# Altium schematic sheet power.SchDoc
size A
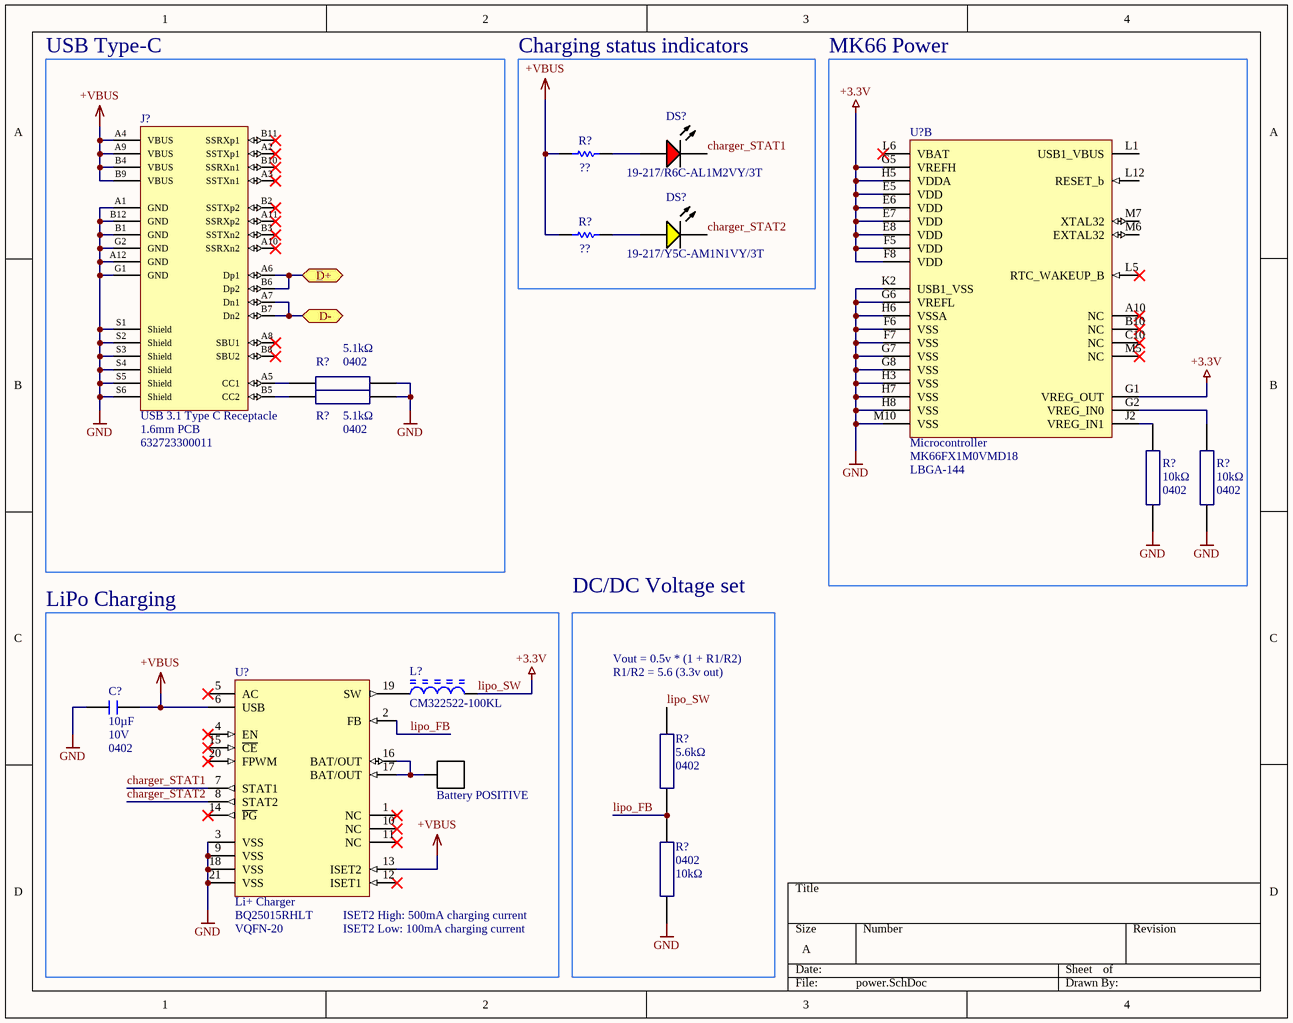
[diagram p0: power.SchDoc]

## Parts
(Parts that share a designator on the sheet are numbered #1, #2 ... from top to bottom, then left to right.)
Battery_POSITIVE  wire_pad_square  [WIRE_PAD_SQUARE]  (value not drawn)  (no BOM)
C?  Capacitance: 10µF  Voltage Rating: 10V  Case Code (Imperial): 0402  [0402_capacitor]  (hidden comment: CL05A106MP8NUB8)
DS?#1  19-217/R6C-AL1M2VY/3T  [EVRL-0603-2_V]
DS?#2  19-217/Y5C-AM1N1VY/3T  [EVRL-0603-2_V]
J?  USB 3.1 Type C Receptacle  PCB Thickness: 1.6mm PCB  [632723300011]
L?  CM322522-100KL  [BOUR-CM322522_V]
R?#1  value ??  [RESC1608X55X25ML10T15]  (hidden comment: Resistor 0R +/- 5% 0603 100 mW)
R?#2  value ??  [RESC1608X55X25ML10T15]  (hidden comment: Resistor 0R +/- 5% 0603 100 mW)
R?#3  Resistance: 5.1kΩ  Size Code: 0402  [0402_resistor]  (hidden comment: RMCF0402FT5K10)
R?#4  Resistance: 5.1kΩ  Size Code: 0402  [0402_resistor]  (hidden comment: RMCF0402FT5K10)
R?#5  Case Code (Imperial): 0402  Resistance: 10kΩ  [0402_resistor]  (hidden comment: RMCF0402FT10K0)
R?#6  Case Code (Imperial): 0402  Resistance: 10kΩ  [0402_resistor]  (hidden comment: RMCF0402FT10K0)
R?#7  Resistance: 5.6kΩ  Size Code: 0402  [0402_resistor]  (hidden comment: RMCF0402FT5K60_1)
R?#8  Case Code (Imperial): 0402  Resistance: 10kΩ  [0402_resistor]  (hidden comment: RMCF0402FT10K0)
U?#1  Microcontroller  Package: LBGA-144  [BGA-144]  (part B of 2)
U?#2  Li+ Charger  [VQFN-20]

## Blocks framed on the sheet
USB Type-C: J? R?#3 R?#4
Charging status indicators: DS?#1 DS?#2 R?#1 R?#2
MK66 Power: R?#5 R?#6 U?#1
LiPo Charging: Battery_POSITIVE C? L? U?#2
DC/DC Voltage set: R?#7 R?#8

## Ports
D+ (bidir), D- (bidir)

## Nets
+VBUS: C?.2 J?.A4(VBUS) J?.A9(VBUS) J?.B4(VBUS) J?.B9(VBUS) R?#1.1 R?#2.1 U?#2.6(USB) U?#2.13(ISET2)
GND: C?.1 J?.A1(GND) J?.A12(GND) J?.B1(GND) J?.B12(GND) J?.G1(GND) J?.G2(GND) J?.S1(Shield) J?.S2(Shield) J?.S3(Shield) J?.S4(Shield) J?.S5(Shield) J?.S6(Shield) R?#3.2 R?#4.2 R?#5.1 R?#6.1 R?#8.1 U?#1.F6(VSS) U?#1.F7(VSS) U?#1.G6(VREFL) U?#1.G7(VSS) U?#1.G8(VSS) U?#1.H3(VSS) U?#1.H6(VSSA) U?#1.H7(VSS) U?#1.H8(VSS) U?#1.K2(USB1_VSS) U?#1.M10(VSS) U?#2.3(VSS) U?#2.9(VSS) U?#2.18(VSS) U?#2.21(VSS)
lipo_SW: L?.2 R?#7.2 U?#1.E5(VDD) U?#1.E6(VDD) U?#1.E7(VDD) U?#1.E8(VDD) U?#1.F5(VDD) U?#1.F8(VDD) U?#1.G1(VREG_OUT) U?#1.G5(VREFH) U?#1.H5(VDDA)  [also labelled +3.3V]
charger_STAT1: DS?#1.2(K) U?#2.7(STAT1)
charger_STAT2: DS?#2.2(K) U?#2.8(STAT2)
D+: J?.A6(Dp1) J?.B6(Dp2) ; port D+
D-: J?.A7(Dn1) J?.B7(Dn2) ; port D-
lipo_FB: R?#7.1 R?#8.2 U?#2.2(FB)
NetBattery_POSITIVE_1: Battery_POSITIVE.1 U?#2.16(BAT/OUT) U?#2.17(BAT/OUT)
NetDS?#1_1: DS?#1.1(A) R?#1.2
NetDS?#2_1: DS?#2.1(A) R?#2.2
NetJ?_A5: J?.A5(CC1) R?#3.1
NetJ?_B5: J?.B5(CC2) R?#4.1
NetL?_1: L?.1 U?#2.19(SW)
NetR?#5_2: R?#5.2 U?#1.J2(VREG_IN1)
NetR?#6_2: R?#6.2 U?#1.G2(VREG_IN0)

Not connected (* = marked no-connect by the designer): J? A2(SSTXp1)* A3(SSTXn1)* A8(SBU1)* A10(SSRXn2)* A11(SSRXp2)* B2(SSTXp2)* B3(SSTXn2)* B8(SBU2)* B10(SSRXn1)* B11(SSRXp1)*; U?#1 A10(NC)* B10(NC)* C10(NC)* L1(USB1_VBUS) L5(RTC_WAKEUP_B)* L6(VBAT)* L12(RESET_b) M5(NC)* M6(EXTAL32) M7(XTAL32); U?#2 1(NC)* 4(EN)* 5(AC)* 10(NC)* 11(NC)* 12(ISET1)* 14(~{PG})* 15(~{CE})* 20(FPWM)*

## Notes on the sheet
- Vout = 0.5v * (1 + R1/R2)
- R1/R2 = 5.6 (3.3v out)
- (near U?#2) ISET2 High: 500mA charging current
- (near U?#2) ISET2 Low: 100mA charging current

## Library data of the parts
Battery_POSITIVE = wire_pad_square: 1.5mm square wire pad
C? = CL05A106MP8NUB8: 10 µF, 10 V, X5R, 0402 Chip capacitor; Manufacturer: Samsung; Tolerance: 20%; Supplier 1: Digi-Key; Supplier Part Number 1: 1276-6830-1-ND; RoHS: Yes; Category: Ceramic Capacitors; Stock 1: 740658; Pricing 1: 1=0.36000, 10=0.25300, 50=0.17720, 100=0.15180, 500=0.11384, 1000=0.09614, 2500=0.09108 (USD); Mount: Surface Mount; Case/Package: 0402; Case Code (Metric): 1005; Min Operating Temperature: -55°C; Max Operating Temperature: 85°C; Packaging: Tape and Reel; Length: 0.039inch; Width: 0.02inch; Thickness: 0.035inch; RoHS Compliant: Yes; ComponentLink1URL: http://www.samsungsem.com/kr/support/product-search/mlcc/CL05A106MP8NUB8.jsp?src-supplier=Digi-Key; ComponentLink1Description: http://www.samsungsem.com/kr/support/product-search/mlcc/CL05A106MP8NUB8.jsp?src-supplier=Digi-Key; Manufacturer Part Number: CL05A106MP8NUB8
DS?#1 = CMP-007-00004-2: Chip LED, Red, 5 V, 25 mA, -40 to 85 degC, 2-Pin SMD (0603), RoHS, Tape and Reel; Manufacturer: Everlight Electronics; Forward Voltage: 2.2V; Lens Style: Clear; Package Reference: 0603; Datasheet Version: Rev. 1, 01/2005; Mounting Technology: SM; RoHS Compliant: False; Datasheet URL: https://datasheet.ciiva.com/4688/el-19-217-r6c-al1m2vy-3tpdf-187026-4688713.pdf; Case/Package: 0603; Colour: Red; Manufacturer URL: http://www.everlight.com/; Package Description: 2-Pin Surface Mount Device, Body 1.6 x 0.8 mm
DS?#2 = CMP-007-00005-2: Chip LED, Yellow, 5 V, 25mA, -40 to 85 degC, 2-Pin SMD (0603), RoHS, Tape and Reel; Manufacturer: Everlight Electronics; Datasheet Version: Rev. 1.0, 12/2005; Package Reference: 0603; Mounting Technology: SM; Package Description: 2-Pin Surface Mount Device, Body 1.6 x 0.8 mm; Case/Package: 0603; Datasheet URL: http://www.fairchip.com/pdf/Everlight/19-217-Y5C-AM1N1VY-3T.pdf; Manufacturer URL: http://www.everlight.com/; RoHS Compliant: False
J? = 632723300011: USB-C jack; Manufacturer: Wurth Electronics; Number of Contacts: 24; Supplier 1: Digi-Key; Stock 1: 18753; Pricing 1: 1=4.1, 10=3.8, 50=3.2, 100=2.95 (USD); Mount: Surface Mount,Through Hole; Packaging: Tape and Reel; Connector Type: USB; Gender: Receptacle; ComponentLink1URL: https://www.mouser.com/ds/2/445/632723x00011-782157.pdf?src-supplier=Mouser; ComponentLink1Description: https://www.mouser.com/ds/2/445/632723x00011-782157.pdf?src-supplier=Mouser; ComponentLink2URL: https://katalog.we-online.de/em/datasheet/632723x00011.pdf?src-supplier=Digi-Key; ComponentLink2Description: https://katalog.we-online.de/em/datasheet/632723x00011.pdf?src-supplier=Digi-Key; Supplier Part Number 1: 732-9618-1-ND; Manufacturer Part Number: 632723300011
L? = CMP-1747-00008-1: Chip Inductor / , 10 uH, +/- 10%, -40 to 125 degC, 1210 (3225 Metric), RoHS, Tape and Reel; Current Rating: 1.5 A; Colour: White; Gender: Female; Connector Type: USB; Min Operating Temperature: -55 degC; ComponentLink2Description: Datasheet; Packaging: Tray; Contact Material: Bronze; ComponentLink1Description: Manufacturer URL; PackageDescription: 2-Pin Surface Mount Device, Body 3.2 x 2.5 mm; Contact Plating: Gold; Max Operating Temperature: 85 degC; ComponentLink2URL: http://www.bourns.com/docs/Product-Datasheets/cm322522.pdf; PackageReference: 1210; Radiation Hardening: No; DatasheetVersion: Aug-14; Package Quantity: 100; Pins: 4; Mount: Through Hole; Lead Pitch: 2.5 mm; ComponentLink1URL: http://www.bourns.com/; Height: 15.9 mm; RoHSCompliant: true; Width: 11.15 mm
R?#1 R?#2 = CMP-009-00006-5: 5.1k; Power: 100mW; Voltage Rating: 50V; Max Operating Temperature: 155°C; RoHS Compliant: True; Mounting Technology: SM; Case/Package: 0603; Min Operating Temperature: -55°C; Tolerance: 5%; Pins: 2
R?#3 R?#4 = RMCF0402FT5K10: 5.1k Ω, 0402 Chip resistor; Manufacturer: Stackpole Electronics; Manufacturer Part Number: RMCF0402FT27R0; Tolerance: 1%; Rated Power Dissipation (P): 63mW; Rated Temperature: 70°C; Temperature Coefficient: 100ppm/°C; Working Voltage: 50V; Package Height: 0.3mm; Package Length: 1mm; Package Width: 0.5mm; Reference Standard: AEC-Q200; RoHS: Yes; Category: Chip SMD Resistors; Stock 1: 3710; Pricing 1: 1=0.10000, 10=0.01500, 100=0.00610, 1000=0.00274, 2500=0.00238, 5000=0.00197 (USD); Mount: Surface Mount; Number of Pins: 2; Package Shape: Rectangular; Terminal Finish: Nickel; Min Operating Temperature: -55°C; Max Operating Temperature: 155°C; JESD-609 Code: e3; Resistor Type: FIXED RESISTOR; Construction: Rectangular; Package Style: SMTMeter; Packaging: Tape and Reel; Technology: METAL GLAZE/THICK FILM; Termination: Wraparound; REACH SVHC: Yes; RoHS Compliant: Yes
R?#5 R?#6 R?#8 = RMCF0402FT10K0: 10 kΩ, 0402 Chip resistor; Manufacturer: Stackpole Electronics; Tolerance: 1%; Power Rating: 62.5mW; Temperature Coefficient: 100ppm/°C; Max Power Dissipation: 63mW; Supplier 1: Digi-Key; Manufacturer Part Number: RMCF0402FT10K0; RoHS: Yes; Category: Chip SMD Resistors; Stock 1: 7219214; Pricing 1: 1=0.10000, 10=0.01300, 100=0.00530, 1000=0.00239, 2500=0.00207, 5000=0.00171 (USD); Mount: Surface Mount; Case/Package: 0402; Case Code (Metric): 1005; Contact Plating: Tin,Matte; Size Code: 0402; Min Operating Temperature: -55°C; Max Operating Temperature: 155°C; Packaging: Tape and Reel; Resistor Type: Thick Film; Number of Terminations: 2; Features: Automotive AEC-Q200; Series: RMCF; Construction: Rectangular; Length: 1mm; Width: 0.02inch; Height: 0.016inch; Depth: 0.5mm; Radiation Hardening: No; Military Standard: Not; Lead Free: Lead Free; RoHS Compliant: Yes; ComponentLink1URL: https://datasheet.ciiva.com/24341/sei-rmcp-24341800.pdf?src-supplier=Onlinecomponents.com; ComponentLink1Description: https://datasheet.ciiva.com/24341/sei-rmcp-24341800.pdf?src-supplier=Onlinecomponents.com; Supplier Part Number 1: RMCF0402FT10K0CT-ND
R?#7 = RMCF0402FT5K60_1: 5.6k Ω, 0402 Chip resistor; Manufacturer: Stackpole Electronics; Manufacturer Part Number: RMCF0402FT27R0; Tolerance: 1%; Rated Power Dissipation (P): 63mW; Rated Temperature: 70°C; Temperature Coefficient: 100ppm/°C; Working Voltage: 50V; Package Height: 0.3mm; Package Length: 1mm; Package Width: 0.5mm; Reference Standard: AEC-Q200; RoHS: Yes; Category: Chip SMD Resistors; Stock 1: 3710; Pricing 1: 1=0.10000, 10=0.01500, 100=0.00610, 1000=0.00274, 2500=0.00238, 5000=0.00197 (USD); Mount: Surface Mount; Number of Pins: 2; Package Shape: Rectangular; Terminal Finish: Nickel; Min Operating Temperature: -55°C; Max Operating Temperature: 155°C; JESD-609 Code: e3; Resistor Type: FIXED RESISTOR; Construction: Rectangular; Package Style: SMTMeter; Packaging: Tape and Reel; Technology: METAL GLAZE/THICK FILM; Termination: Wraparound; REACH SVHC: Yes; RoHS Compliant: Yes
U?#1 = MK66FX1M0VMD18: ARM Cortex-M4 microcontroller; Manufacturer: NXP Freescale; Supplier 1: Digi-Key; Stock 1: 0; Pricing 1: 1=23.34, 10=23.108 (USD); RoHS Compliant: Yes; ComponentLink1URL: http://www.mouser.com/ds/2/302/K66P144M180SF5V2-907544.pdf?src-supplier=Mouser; ComponentLink1Description: http://www.mouser.com/ds/2/302/K66P144M180SF5V2-907544.pdf?src-supplier=Mouser; ComponentLink2URL: https://www.nxp.com/docs/en/package-information/98ASA00222D.pdf?src-supplier=Digi-Key; ComponentLink2Description: https://www.nxp.com/docs/en/package-information/98ASA00222D.pdf?src-supplier=Digi-Key; ComponentLink3URL: http://www.farnell.com/datasheets/2292635.pdf?src-supplier=Farnell; ComponentLink3Description: http://www.farnell.com/datasheets/2292635.pdf?src-supplier=Farnell; ComponentLink4URL: http://www.farnell.com/datasheets/2292635.pdf?src-supplier=Newark; ComponentLink4Description: http://www.farnell.com/datasheets/2292635.pdf?src-supplier=Newark; Supplier Part Number 1: 568-13335-ND; Manufacturer Part Number: MK66FX1M0VMD18
U?#2 = BQ25015RHLT: Li+ Battery Chager, VQFN-20; Manufacturer: Texas Instruments; Output Voltage: 700mV; Output Current: 500mA; Number of Cells: 1; Max Supply Voltage: 6.5V; Min Supply Voltage: 4.35V; Min Input Voltage: 4.5V; Switching Frequency: 1MHz; Supplier 1: Digi-Key; Stock 1: 62; Pricing 1: 1=4.78, 10=4.289, 25=4.0544, 100=3.5139 (USD); Case/Package: VQFN; Number of Pins: 20; Weight: 0.001668oz; Contact Plating: Gold; Min Operating Temperature: -40°C; Max Operating Temperature: 125°C; Package Quantity: 1; Series: -; Packaging: Tape and Reel; Max Output Current: 500mA; Max Charge Current: 500mA; Length: 4.5mm; Width: 3.5mm; Height: 0.9mm; Radiation Hardening: No; REACH SVHC: No SVHC; Lead Free: Lead Free; RoHS Compliant: Yes; ComponentLink1URL: http://www.ti.com/lit/ds/symlink/bq25017.pdf?src-supplier=Farnell; ComponentLink1Description: http://www.ti.com/lit/ds/symlink/bq25017.pdf?src-supplier=Farnell; ComponentLink2URL: http://www.ti.com/lit/ds/symlink/bq25017.pdf?src-supplier=Element14; ComponentLink2Description: http://www.ti.com/lit/ds/symlink/bq25017.pdf?src-supplier=Element14; ComponentLink3URL: http://www.ti.com/general/docs/suppproductinfo.tsp?distId=10&amp;gotoUrl=http%3A%2F%2Fwww.ti.com%2Flit%2Fgpn%2Fbq25015&src-supplier=Digi-Key; ComponentLink3Description: http://www.ti.com/general/docs/suppproductinfo.tsp?distId=10&amp;gotoUrl=http%3A%2F%2Fwww.ti.com%2Flit%2Fgpn%2Fbq25015&src-supplier=Digi-Key; ComponentLink4URL: https://media.digikey.com/pdf/Data%20Sheets/Texas%20Instruments%20PDFs/BQ25015,17.pdf?src-supplier=Digi-Key; ComponentLink4Description: https://media.digikey.com/pdf/Data%20Sheets/Texas%20Instruments%20PDFs/BQ25015,17.pdf?src-supplier=Digi-Key; ComponentLink5URL: http://www.ti.com/lit/gpn/bq25015?src-supplier=Mouser; ComponentLink5Description: http://www.ti.com/lit/gpn/bq25015?src-supplier=Mouser; ComponentLink6URL: http://www.ti.com/general/docs/lit/getliterature.tsp?genericPartNumber=BQ25017&&fileType=pdf&src-supplier=Avnet; ComponentLink6Description: http://www.ti.com/general/docs/lit/getliterature.tsp?genericPartNumber=BQ25017&&fileType=pdf&src-supplier=Avnet; Supplier Part Number 1: 296-32034-1-ND; Manufacturer Part Number: BQ25015RHLT; Package: VQFN-20